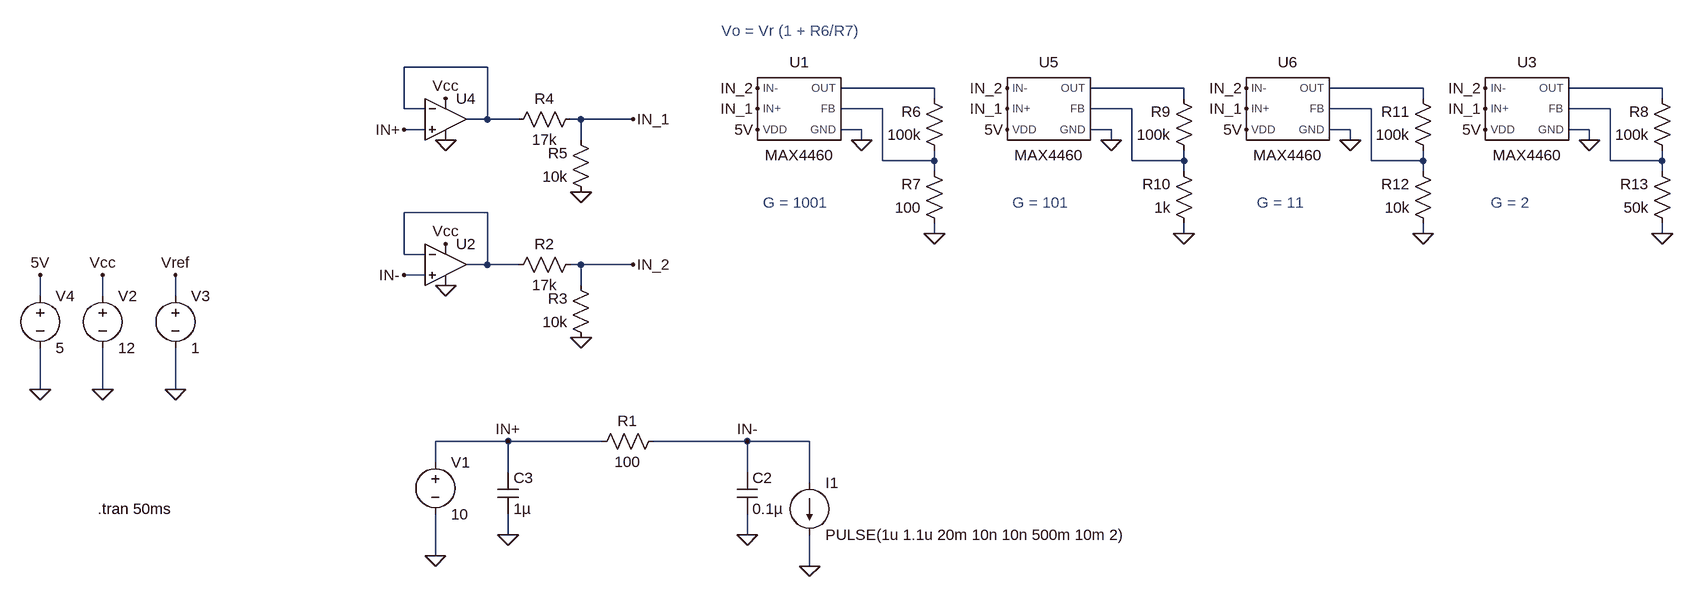
[diagram p0: schematic amplifier.asc]
amplifier.asc, the LTspice schematic file:
Version 4
SHEET 1 1268 680
WIRE -560 -624 -688 -624
WIRE 128 -592 -16 -592
WIRE 512 -592 368 -592
WIRE 880 -592 736 -592
WIRE 1248 -592 1104 -592
WIRE 128 -576 128 -592
WIRE 512 -576 512 -592
WIRE 880 -576 880 -592
WIRE 1248 -576 1248 -592
WIRE -688 -560 -688 -624
WIRE -656 -560 -688 -560
WIRE 48 -560 -16 -560
WIRE 432 -560 368 -560
WIRE 800 -560 736 -560
WIRE 1168 -560 1104 -560
WIRE -560 -544 -560 -624
WIRE -560 -544 -592 -544
WIRE -512 -544 -560 -544
WIRE -416 -544 -432 -544
WIRE -336 -544 -416 -544
WIRE -656 -528 -688 -528
WIRE 16 -528 -16 -528
WIRE 400 -528 368 -528
WIRE 768 -528 736 -528
WIRE 1136 -528 1104 -528
WIRE -416 -512 -416 -544
WIRE 16 -512 16 -528
WIRE 400 -512 400 -528
WIRE 768 -512 768 -528
WIRE 1136 -512 1136 -528
WIRE 48 -480 48 -560
WIRE 128 -480 128 -496
WIRE 128 -480 48 -480
WIRE 432 -480 432 -560
WIRE 512 -480 512 -496
WIRE 512 -480 432 -480
WIRE 800 -480 800 -560
WIRE 880 -480 880 -496
WIRE 880 -480 800 -480
WIRE 1168 -480 1168 -560
WIRE 1248 -480 1248 -496
WIRE 1248 -480 1168 -480
WIRE 128 -464 128 -480
WIRE 512 -464 512 -480
WIRE 880 -464 880 -480
WIRE 1248 -464 1248 -480
WIRE -560 -400 -688 -400
WIRE 128 -368 128 -384
WIRE 512 -368 512 -384
WIRE 880 -368 880 -384
WIRE 1248 -368 1248 -384
WIRE -688 -336 -688 -400
WIRE -656 -336 -688 -336
WIRE -560 -320 -560 -400
WIRE -560 -320 -592 -320
WIRE -512 -320 -560 -320
WIRE -416 -320 -432 -320
WIRE -336 -320 -416 -320
WIRE -656 -304 -688 -304
WIRE -416 -288 -416 -320
WIRE -1248 -272 -1248 -304
WIRE -1152 -272 -1152 -304
WIRE -1040 -272 -1040 -304
WIRE -1248 -128 -1248 -192
WIRE -1152 -128 -1152 -192
WIRE -1040 -128 -1040 -192
WIRE -528 -48 -640 -48
WIRE -384 -48 -528 -48
WIRE -160 -48 -304 -48
WIRE -64 -48 -160 -48
WIRE -640 -16 -640 -48
WIRE -528 0 -528 -48
WIRE -160 0 -160 -48
WIRE -64 16 -64 -48
WIRE -528 96 -528 64
WIRE -160 96 -160 64
WIRE -640 128 -640 64
WIRE -64 144 -64 96
FLAG -640 128 0
FLAG -64 144 0
FLAG -160 96 0
FLAG -528 96 0
FLAG -528 -48 IN+
FLAG -160 -48 IN-
FLAG -1152 -128 0
FLAG -1040 -128 0
FLAG -1040 -304 Vref
FLAG -1152 -304 Vcc
FLAG -624 -288 0
FLAG -624 -352 Vcc
FLAG -624 -576 Vcc
FLAG -688 -528 IN+
FLAG -688 -304 IN-
FLAG -336 -544 IN_1
FLAG -336 -320 IN_2
FLAG -144 -560 IN_1
FLAG -144 -592 IN_2
FLAG -1248 -128 0
FLAG -1248 -304 5V
FLAG -144 -528 5V
FLAG -624 -512 0
FLAG -416 -432 0
FLAG -416 -208 0
FLAG 240 -560 IN_1
FLAG 240 -592 IN_2
FLAG 240 -528 5V
FLAG 400 -512 0
FLAG 512 -368 0
FLAG 608 -560 IN_1
FLAG 608 -592 IN_2
FLAG 608 -528 5V
FLAG 768 -512 0
FLAG 880 -368 0
FLAG 16 -512 0
FLAG 128 -368 0
FLAG 976 -560 IN_1
FLAG 976 -592 IN_2
FLAG 976 -528 5V
FLAG 1136 -512 0
FLAG 1248 -368 0
SYMBOL voltage -640 -32 R0
WINDOW 123 0 0 Left 0
WINDOW 39 0 0 Left 0
SYMATTR InstName V1
SYMATTR Value 10
SYMBOL res -288 -64 R90
WINDOW 0 0 56 VBottom 2
WINDOW 3 32 56 VTop 2
SYMATTR InstName R1
SYMATTR Value 100
SYMBOL cap -176 0 R0
SYMATTR InstName C2
SYMATTR Value 0.1µ
SYMBOL current -64 16 R0
WINDOW 123 0 0 Left 0
WINDOW 39 0 0 Left 0
SYMATTR InstName I1
SYMATTR Value PULSE(1u 1.1u 20m 10n 10n 500m 10m 2)
SYMBOL cap -544 0 R0
SYMATTR InstName C3
SYMATTR Value 1µ
SYMBOL voltage -1152 -288 R0
WINDOW 123 0 0 Left 0
WINDOW 39 0 0 Left 0
SYMATTR InstName V2
SYMATTR Value 12
SYMBOL voltage -1040 -288 R0
WINDOW 123 0 0 Left 0
WINDOW 39 0 0 Left 0
SYMATTR InstName V3
SYMATTR Value 1
SYMBOL res -416 -336 R90
WINDOW 0 0 56 VBottom 2
WINDOW 3 32 56 VTop 2
SYMATTR InstName R2
SYMATTR Value 17k
SYMBOL res -400 -192 R180
WINDOW 0 36 76 Left 2
WINDOW 3 36 40 Left 2
SYMATTR InstName R3
SYMATTR Value 10k
SYMBOL OpAmps\\UniversalOpamp -624 -320 R0
SYMATTR InstName U2
SYMBOL res -416 -560 R90
WINDOW 0 0 56 VBottom 2
WINDOW 3 32 56 VTop 2
SYMATTR InstName R4
SYMATTR Value 17k
SYMBOL res -400 -416 R180
WINDOW 0 36 76 Left 2
WINDOW 3 36 40 Left 2
SYMATTR InstName R5
SYMATTR Value 10k
SYMBOL OpAmps\\UniversalOpamp -624 -544 R0
SYMATTR InstName U4
SYMBOL res 144 -480 R180
WINDOW 0 36 76 Left 2
WINDOW 3 36 40 Left 2
SYMATTR InstName R6
SYMATTR Value 100k
SYMBOL res 144 -368 R180
WINDOW 0 36 76 Left 2
WINDOW 3 36 40 Left 2
SYMATTR InstName R7
SYMATTR Value 100
SYMBOL MAX4460 -80 -560 R0
SYMATTR InstName U1
SYMBOL voltage -1248 -288 R0
WINDOW 123 0 0 Left 0
WINDOW 39 0 0 Left 0
SYMATTR InstName V4
SYMATTR Value 5
SYMBOL res 528 -480 R180
WINDOW 0 36 76 Left 2
WINDOW 3 36 40 Left 2
SYMATTR InstName R9
SYMATTR Value 100k
SYMBOL res 528 -368 R180
WINDOW 0 36 76 Left 2
WINDOW 3 36 40 Left 2
SYMATTR InstName R10
SYMATTR Value 1k
SYMBOL MAX4460 304 -560 R0
SYMATTR InstName U5
SYMBOL res 896 -480 R180
WINDOW 0 36 76 Left 2
WINDOW 3 36 40 Left 2
SYMATTR InstName R11
SYMATTR Value 100k
SYMBOL res 896 -368 R180
WINDOW 0 36 76 Left 2
WINDOW 3 36 40 Left 2
SYMATTR InstName R12
SYMATTR Value 10k
SYMBOL MAX4460 672 -560 R0
SYMATTR InstName U6
SYMBOL res 1264 -480 R180
WINDOW 0 36 76 Left 2
WINDOW 3 36 40 Left 2
SYMATTR InstName R8
SYMATTR Value 100k
SYMBOL res 1264 -368 R180
WINDOW 0 36 76 Left 2
WINDOW 3 36 40 Left 2
SYMATTR InstName R13
SYMATTR Value 50k
SYMBOL MAX4460 1040 -560 R0
SYMATTR InstName U3
TEXT -1160 56 Left 2 !.tran 50ms
TEXT -200 -680 Left 2 ;Vo = Vr (1 + R6/R7)
TEXT -136 -416 Left 2 ;G = 1001
TEXT 248 -416 Left 2 ;G = 101
TEXT 624 -416 Left 2 ;G = 11
TEXT 984 -416 Left 2 ;G = 2

The netlist it stands for:
* amplifier.asc
V1 IN+ 0 10
R1 IN- IN+ 100
C2 IN- 0 0.1µ
I1 IN- 0 PULSE(1u 1.1u 20m 10n 10n 500m 10m 2)
C3 IN+ 0 1µ
V2 Vcc 0 12
V3 Vref 0 1
R2 IN_2 N010 17k
R3 0 IN_2 10k
XU2 IN- N010 Vcc 0 N010 level1 Avol=1Meg GBW=10Meg Vos=0 En=0 Enk=0 In=0 Ink=0 Rin=500Meg  ; pins In+ In- V+ V- OUT
R4 IN_1 N001 17k
R5 0 IN_1 10k
XU4 IN+ N001 Vcc 0 N001 level1 Avol=1Meg GBW=10Meg Vos=0 En=0 Enk=0 In=0 Ink=0 Rin=500Meg  ; pins In+ In- V+ V- OUT
R6 N006 N002 100k
R7 0 N006 100
XU1 N002 0 IN_1 IN_2 5V N006 MAX4460  ; pins OUT GND IN+ IN- VDD FB
V4 5V 0 5
R9 N007 N003 100k
R10 0 N007 1k
XU5 N003 0 IN_1 IN_2 5V N007 MAX4460  ; pins OUT GND IN+ IN- VDD FB
R11 N008 N004 100k
R12 0 N008 10k
XU6 N004 0 IN_1 IN_2 5V N008 MAX4460  ; pins OUT GND IN+ IN- VDD FB
R8 N009 N005 100k
R13 0 N009 50k
XU3 N005 0 IN_1 IN_2 5V N009 MAX4460  ; pins OUT GND IN+ IN- VDD FB
.tran 50ms
* Vo = Vr (1 + R6/R7)
* G = 1001
* G = 101
* G = 11
* G = 2
.lib UniversalOpAmp1.lib
.lib D:\Users\javi_\GitHub\Microwatt_Board\Simu_Microwatt_Board\MAX4460.lib
.backanno
.end